# EAGLE design Xadow_IO (EAGLE 6.5.0)
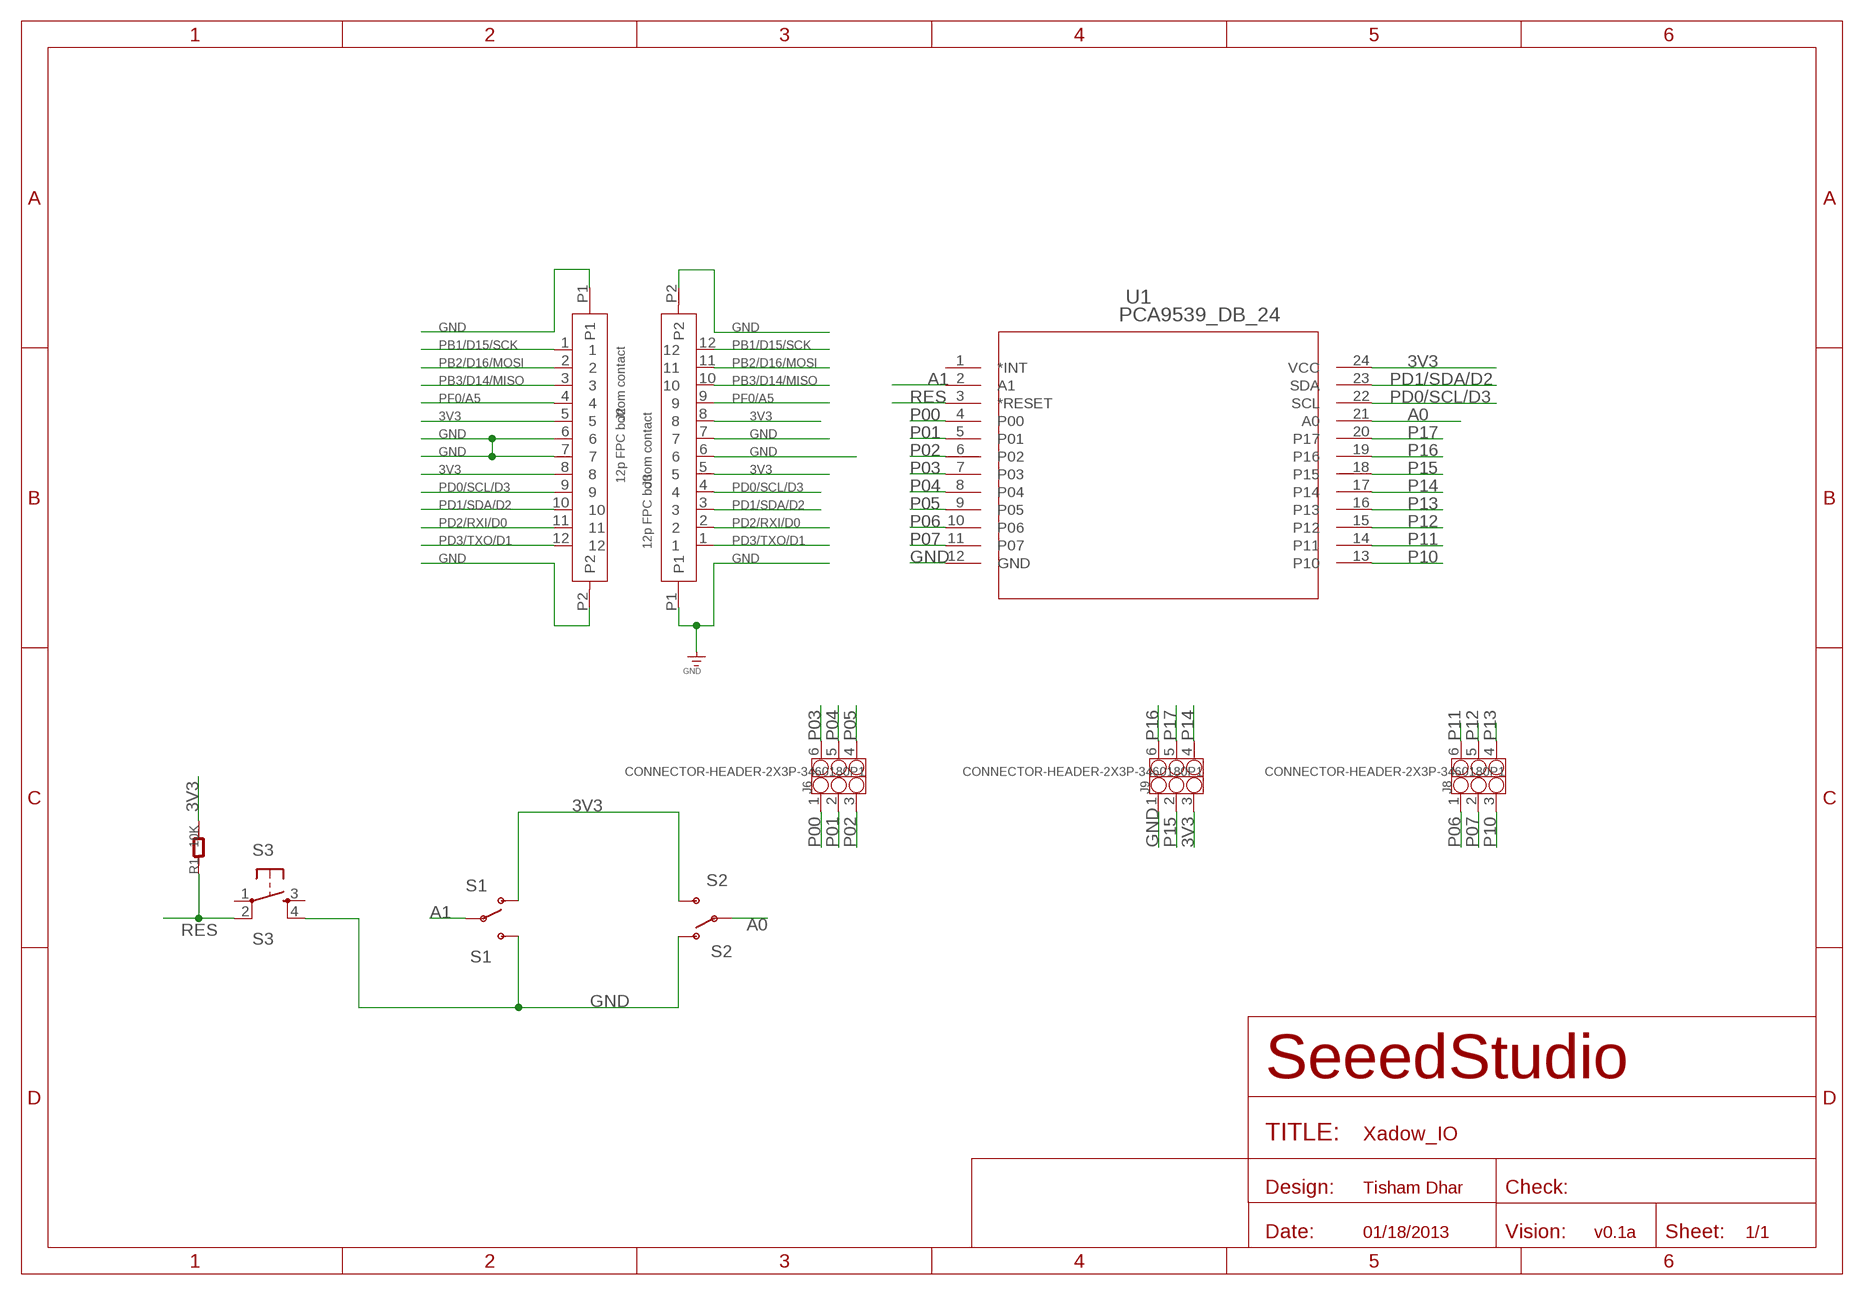
[diagram p0: schematic, sheet 1]

## Parts
J2  12p FPC bottom contact  FPC052002-12LT  [12P-0.5]
J3  12p FPC bottom contact  FPC052002-12LT  [12P-0.5]
J6  CONNECTOR-HEADER-2X3P-3460180P1  [2X3P-2.54-2.54-11.6-3.0-BLACK-MALE]
J8  CONNECTOR-HEADER-2X3P-3460180P1  [2X3P-2.54-2.54-11.6-3.0-BLACK-MALE]
J9  CONNECTOR-HEADER-2X3P-3460180P1  [2X3P-2.54-2.54-11.6-3.0-BLACK-MALE]
R1  10K  R-0603  [R0603]
S1  S1  SWITCH-SPDT-SMD-A  [SWITCH-SPST-SMD-A]
S2  S2  SWITCH-SPDT-SMD-A  [SWITCH-SPST-SMD-A]
S3  S3  TAC_SWITCHSMD  [TACTILE_SWITCH_SMD]
U1  PCA9539_DB_24  [DB24]

## Nets
3V3: J2.5 J2.8 J3.5 J3.8 J9.3 R1.2 S1.1(O) S2.3(S) U1.24(VCC)
A0: S2.2(P) U1.21(A0)
A1: S1.2(P) U1.2(A1)
GND: J2.6 J2.7 J2.P1 J2.P2 J3.6 J3.7 J3.P1 J3.P2 J9.1 S1.3(S) S2.1(O) S3.4 U1.12(GND)
P00: J6.1 U1.4(P00)
P01: J6.2 U1.5(P01)
P02: J6.3 U1.6(P02)
P03: J6.6 U1.7(P03)
P04: J6.5 U1.8(P04)
P05: J6.4 U1.9(P05)
P06: J8.1 U1.10(P06)
P07: J8.2 U1.11(P07)
P10: J8.3 U1.13(P10)
P11: J8.6 U1.14(P11)
P12: J8.5 U1.15(P12)
P13: J8.4 U1.16(P13)
P14: J9.4 U1.17(P14)
P15: J9.2 U1.18(P15)
P16: J9.6 U1.19(P16)
P17: J9.5 U1.20(P17)
PB1/D15/SCK: J2.1 J3.12
PB2/D16/MOSI: J2.2 J3.11
PB3/D14/MISO: J2.3 J3.10
PD0/SCL/D3: J2.9 J3.4 U1.22(SCL)
PD1/SDA/D2: J2.10 J3.3 U1.23(SDA)
PD2/RXI/D0: J2.11 J3.2
PD3/TXO/D1: J2.12 J3.1
PF0/A5: J2.4 J3.9
RES: R1.1 S3.2 U1.3(*RESET)
Unconnected: S3.1 S3.3 U1.1(*INT)

## Notes on the sheet
- Tisham Dhar
- 01/18/2013 | v0.1a

## Library data of the parts
J2 J3 = template:FPC052002-12LT
J6 J8 J9 = OPL:CONNECTOR-HEADER-2X3P
R1 = OPL:R*
S1 S2 = SparkFun-Electromechanical:SWITCH-SPDT: SPDT Switch Simple slide switch, Spark Fun Electronics SKU : COM-00102 DPDT SMT slide switch, AYZ0202, SWCH-08179
S3 = SparkFun-Electromechanical:TAC_SWITCH: Momentary Switch Button commonly used for reset or general input. Spark Fun Electronics SKU : COM-00097 SMT- SWCH-08247; PROD_ID: SWCH-08247
U1 = PCA9539:PCA9539_DB_24; DATASHEETURL: http://www.ti.com/lit/gpn/PCA9539; DESCRIPTION: Remote 16-Bit I2C And SMBus, Low-Power I/O Expander With Interrupt Output, Reset & Config. Registers; FAMILY_NAME: I2C IO EXPANDER; GENERIC_PART_NUMBER: PCA9539; INDUSTRY_STD_PKG_TYPE: SSOP; MANUFACTURER: Texas Instruments; MANUFACTURER_PART_NUMBER: pca9539_db_24; PACKAGE_DESIGNATOR: DB; PIN_COUNT: 24; VENDOR: Texas Instruments

## Net classes
0 default: width 0.152 mm, drill 0.305 mm, clearance 0.152 mm
1 GND: width 0.152 mm, drill 0.305 mm, clearance 0.152 mm to class 0, clearance 0.152 mm
3 usbvcc: width 0.203 mm, drill 0.305 mm, clearance 0.203 mm

## Board
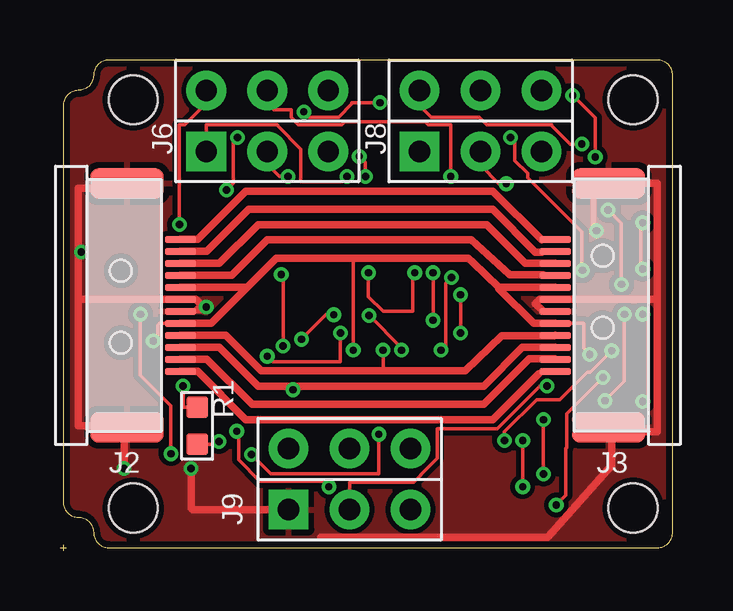
[diagram p1: board, top side]
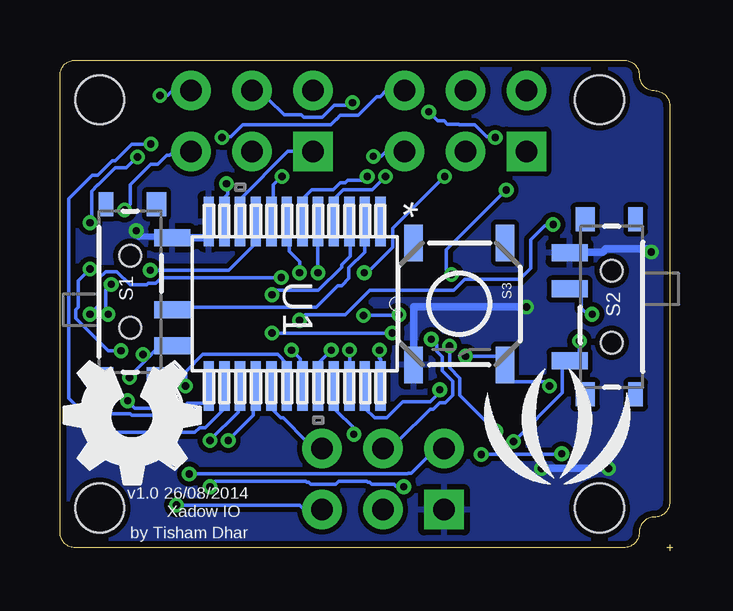
[diagram p2: board, bottom side, seen from below]

Size 25.53 x 20.45 mm. Coordinates in mm from the lower left corner, seen from the top.
Outline: 25.53,19.81 arc90 24.89,20.45
Outline: 2.03,20.45 arc90 1.4,19.81
Outline: 1.4,19.81 arc-90 0.76,19.18
Outline: 0.76,19.18 arc90 0.13,18.54
Outline: 0.13,2.03 arc90 0.76,1.4
Outline: 0.76,1.4 arc-90 1.4,0.76
Outline: 1.4,0.76 arc90 2.03,0.13
Outline: 24.89,0.13 arc90 25.53,0.76
Outline: 25.53,0.76 25.53,19.81
Outline: 25.53,19.81 arc90 24.89,20.45
Outline: 24.89,20.45 2.03,20.45
Outline: 2.03,20.45 arc90 1.4,19.81
Outline: 1.4,19.81 arc-90 0.76,19.18
Outline: 0.76,19.18 arc90 0.13,18.54
Outline: 0.13,18.54 0.13,2.03
Outline: 0.13,2.03 arc90 0.76,1.4
Outline: 0.76,1.4 arc-90 1.4,0.76
Outline: 1.4,0.76 1.4,0.76
Outline: 1.4,0.76 arc90 2.03,0.13
Outline: 2.03,0.13 24.89,0.13
Outline: 24.89,0.13 arc90 25.53,0.76
Outline: 0,0.13 0.25,0.13
Outline: 0.13,0.25 0.13,0
Copper layers (1*16): Top 0.035mm / dielectric 1.5mm / Bottom 0.035mm
Design rules "SeeedStudio_2layer_DRU_no_angle_20140221": minimum track width 6mil, minimum drill 12mil, track to track 6mil, track to pad 6mil, pad to pad 6mil, via to via 6mil, smd to smd 0mil, copper to edge 10mil, drill to drill 10mil, minimum pad ring 10mil, minimum via ring 6mil, stop-mask expansion 2mil, vias tented up to drill 100mil, thermal gap 10mil
Holes 2.03 mm at 3.05,1.78 3.05,18.8 23.88,18.8 23.88,1.78
tRestrict: area 20.3,10 to 21,10.5; area 4.8,10 to 5.3,10.5

### Footprints (pad centres in the part's own frame; a part is rotated, then mirrored left to right if it is on the bottom)
12P-0.5 = smd 0.3 x 1.3: 1 -2.75,2.35; 2 -2.25,2.35; 3 -1.75,2.35; 4 -1.25,2.35; 5 -0.75,2.35; 6 -0.25,2.35; 7 0.25,2.35; 8 0.75,2.35; 9 1.25,2.35; 10 1.75,2.35; 11 2.25,2.35; 12 2.75,2.35 | smd 1.27 x 3.048: P1 -5.08,0.127; P2 5.08,0.127
2X3P-2.54-2.54-11.6-3.0-BLACK-MALE = drill 0.889 pad 1.651 square: 1 -1.27,2.54 | drill 0.889 pad 1.651: 2 -1.27,0; 3 -1.27,-2.54; 4 1.27,-2.54; 5 1.27,0; 6 1.27,2.54
R0603 = smd 0.889 x 0.889: 1 -0.762,0; 2 0.762,0
SWITCH-SPST-SMD-A = smd 0.7 x 1.5: 1 -2.25,-1.75; 2 -0.75,-1.75; 3 2.25,-1.75 | smd 1 x 0.6: GND1 -3.65,1; GND3 3.65,1 | smd 1 x 0.8: GND2 -3.65,-1.1; GND4 3.65,-1.1 | hole 0.9: -1.5,0; 1.5,0
TACTILE_SWITCH_SMD = smd 1.524 x 0.762: 1 -2.54,1.905; 2 2.54,1.905; 3 -2.54,-1.905; 4 2.54,-1.905
DB24 = smd 2.057 x 0.432: 1 -3.429,3.581; 2 -3.429,2.921; 3 -3.429,2.286; 4 -3.429,1.626; 5 -3.429,0.965; 6 -3.429,0.33; 7 -3.429,-0.33; 8 -3.429,-0.965; 9 -3.429,-1.626; 10 -3.429,-2.286; 11 -3.429,-2.921; 12 -3.429,-3.581; 13 3.429,-3.581; 14 3.429,-2.921; 15 3.429,-2.286; 16 3.429,-1.626; 17 3.429,-0.965; 18 3.429,-0.33; 19 3.429,0.33; 20 3.429,0.965; 21 3.429,1.626; 22 3.429,2.286; 23 3.429,2.921; 24 3.429,3.581

### Placement (x,y rotation side)
J2  2.67,10.22 270 top
J3  22.99,10.22 90 top
J6  8.64,17.91 90 top
J8  17.53,17.91 90 top
J9  12.07,2.98 90 top
R1  5.72,5.21 270 top
S1  22.61,10.79 90 bottom
S2  2.54,10.16 270 bottom
S3  8.89,10.29 270 bottom
U1  15.75,10.29 270 bottom
U$2  [LOGO_SILK]  4.83,4.45 0 bottom
U$3  [OSHW_FILLX200_NOTEXT]  19.69,7.87 180 bottom

### Tracks (layer width: path | path; a pad name or v marks a point on that pad's centre or on a via)
3V3  (via drill 0.3)
  Top 0.152: J3.8 20.14,11 20.14,10.98 | 20.19,10.97 20.14,10.98 | 20.14,10.98 20.07,10.99 | 4.88,9.47 J2.8 4.8,9.47 4.14,9.47 4.06,9.4 4.06,8.92 v3.89,8.74 | v20.68,1.91 21.08,2.31 21.08,4.27 21.11,4.29 21.11,5.71 22.61,7.21 v22.63,7.21 | v22.07,8.18 21.82,8.43 21.82,9.47 20.78,9.47 J3.5 | 12.22,12.19 v12.22,8.36 | R1.2 6.53,4.45 v6.63,4.55
  Top 0.305: J2.5 7.8,10.97 | 7.8,10.97 9.02,12.19 12.22,12.19 17.02,12.19 17.2,12.02 18.29,10.99 | J2.8 6.3,9.47 7.8,10.97 | J3.5 19.74,9.47 18.29,10.92 18.29,10.99 | 18.29,10.99 20.64,10.99 J3.8
  Bottom 0.152: v20.68,1.91 15.55,1.91 15.37,1.73 14.61,1.73 J9.3 | v22.63,7.21 22.61,7.24 22.61,7.29 21.9,8 | 21.9,8 21.49,8.41 21.49,8.53 20.88,8.53 S1.1 | 21.9,8 v22.07,8.18 | v3.89,8.74 3.89,7.9 4.27,7.9 S2.3 4.34,7.9 4.6,7.9 4.6,6.58 v6.63,4.55 | U1.24 12.17,7.98 12.22,8.03 v12.22,8.36
A0  (via drill 0.3)
  Top 0.152: v3.35,9.86 3.35,7.32 4.62,6.05 v4.62,4.04 | v7.98,4.01 8.79,3.2 13.28,3.2 v13.28,4.85
  Bottom 0.152: v3.35,9.86 3.56,9.86 3.81,10.11 3.81,10.9 3.84,10.92 4.27,10.92 S2.2 | v4.62,4.04 4.65,4.01 v7.98,4.01 | v13.28,4.85 13.23,4.9 13.23,5.05 14.12,5.94 U1.21
A1
  Bottom 0.152: U1.2 12.83,12.45 13.49,11.79 13.49,11.35 13.79,11.05 13.95,11.05 14.86,10.14 20.12,10.14 20.22,10.03 S1.2
GND  (via drill 0.3)
  Top 0.152: 4.47,9.98 4.75,9.98 4.78,9.96 5,9.96 J2.7 5.08,9.96 5.39,9.96 5.41,9.98 5.59,9.98 5.72,10.03 | 20.07,10.03 20.19,9.98 20.24,9.98 20.27,9.96 20.62,9.96 J3.6 20.7,9.96 21.01,9.96 21.03,9.98
  Top 0.254: v22.35,13.34 22.23,13.46 22.23,15.24 J3.P2
  Top 0.305: 5.84,10.16 5.84,10.29 5.66,10.47 J2.6 0.76,10.47 | 5.84,10.16 5.72,10.03 | 20.07,10.03 19.81,10.29 20,10.47 J3.7 24.89,10.47 | J9.1 5.53,1.71 5.46,1.78 v5.46,3.43 | 0.76,10.47 0.76,12.45 | 0.76,12.45 0.76,15.11 1.65,15.11 1.65,15.24 | 0.76,10.47 0.76,5.21 2.67,5.21 2.73,5.14 J2.P2 2.67,5.08 v2.67,3.43 | 24.89,10.47 24.89,15.3 J3.P2 22.73,15.37 22.23,15.37 | 24.89,10.47 24.89,4.95 22.86,4.95 J3.P1 22.99,5.14 22.99,3.56 20.32,0.57 10.86,0.57 | v6.1,10.16 5.97,10.03 5.84,10.03 5.84,10.16 | v0.89,12.45 0.76,12.45
  Bottom 0.254: S1.3 21.08,13.08 22.23,13.08 22.35,13.21 v22.35,13.34
  Bottom 0.305: U1.12 19.33,13.04 S1.3 20.95,13.08 | S3.4 10.8,10.16 v6.1,10.16 | S2.1 4.19,12.45 2.92,12.45 2.79,12.57 0.89,12.57 0.76,12.45 v0.89,12.45 | v5.46,3.43 v2.67,3.43
  pour Top (isolate 0.203): 0.13,0.13 25.53,0.13 25.53,20.45 0.13,20.45
  pour Bottom (isolate 0.203): 0.13,0.13 25.53,0.13 25.53,20.45 0.13,20.45
P00  (via drill 0.3)
  Top 0.152: v11.96,15.6 11.73,15.37 10.03,15.37 10.03,16.74 9.07,17.7 9.07,17.73 9.04,17.75 6.1,17.75 J6.1
  Bottom 0.152: U1.4 14.12,14.66 14.1,14.66 13.72,15.04 12.52,15.04 v11.96,15.6
P01  (via drill 0.3)
  Top 0.152: J6.2 8.64,16.1 9.14,15.6 v9.5,15.6 | v12.85,11.58 12.85,10.59 13.46,9.98 14.71,9.98 14.71,11.51 v14.78,11.58
  Bottom 0.152: v9.5,15.6 11.66,13.44 11.66,12.65 12.7,11.61 12.83,11.61 v12.85,11.58 | U1.5 v14.78,11.58
P02  (via drill 0.3)
  Top 0.152: v12.47,16.43 12.73,16.18 v12.73,15.6
  Bottom 0.152: J6.3 11.94,16.64 12.14,16.43 v12.47,16.43 | v12.73,15.6 12.88,15.44 13.54,15.44 13.64,15.34 13.84,15.34 14.15,15.04 15.04,15.04 15.42,14.66 U1.6
P03  (via drill 0.3)
  Top 0.152: J6.6 6.1,18.64 5.21,17.75 4.98,17.75 v4.98,13.59 | v15.55,11.58 v15.55,9.6
  Bottom 0.152: v4.98,13.59 5.03,13.54 5.33,13.54 5.92,12.95 5.92,11.76 6.38,11.3 8.66,11.3 9.12,10.85 12.62,10.85 13.64,9.83 15.32,9.83 v15.55,9.6 | v15.55,11.58 15.55,12.04 15.98,12.47 15.98,12.75 16.08,12.85 U1.7
P04  (via drill 0.3)
  Top 0.152: J6.5 8.64,18.64 8.92,18.36 9.63,18.36 9.63,18.06 9.93,17.75 11.73,17.75 11.86,17.88 15.22,17.88 15.34,17.75 16.28,17.75 v16.28,15.6
  Bottom 0.152: v16.28,15.6 16.64,15.24 16.64,14.68 16.71,14.61 U1.8
P05  (via drill 0.3)
  Top 0.152: v18.77,17.22 18.95,17.04 18.95,16.26 19.48,15.72 19.48,15.54 21.74,13.28 21.74,11.71 v21.77,11.68
  Bottom 0.152: J6.4 11.94,19.18 12.19,18.92 12.32,18.92 13.11,18.14 13.84,18.14 14,17.98 14.02,17.98 14.25,17.75 17.91,17.75 18.41,17.25 18.75,17.25 v18.77,17.22 | v21.77,11.68 21.74,11.66 21.46,11.66 21.44,11.68 18.49,11.68 17.37,12.8 U1.9
P06
  Bottom 0.152: J8.1 16.03,16.64 18.03,14.63 U1.10
P07  (via drill 0.3)
  Top 0.152: v18.59,15.29 18.29,15.29 17.53,16.05 J8.2
  Bottom 0.152: U1.11 18.67,14.73 18.54,14.86 18.54,15.24 v18.59,15.29
P10  (via drill 0.3)
  Top 0.152: v22.71,6.25 23.52,7.06 v23.52,9.86 | v23.39,11.1 23.39,13.64 v22.84,14.2
  Bottom 0.152: U1.13 19.33,6.15 20.22,6.15 20.42,5.94 22.4,5.94 v22.71,6.25 | v23.52,9.86 23.62,9.96 23.62,10.87 v23.39,11.1 | v22.84,14.2 22.61,14.43 22.61,15.24 21.74,16.1 21.46,16.1 21.08,16.49 20.95,16.49 20.8,16.64 J8.3
P11  (via drill 0.3)
  Top 0.152: J8.6 14.99,18.54 15.47,18.06 17.48,18.06 17.78,17.75 20.5,17.75 20.5,17.7 21.26,16.94 v21.74,16.94
  Bottom 0.152: v21.74,16.94 22.53,16.94 23.22,16.26 23.34,16.26 23.95,15.65 24.18,15.65 25.17,14.66 25.17,6.35 23.75,4.93 19.91,4.93 19.71,5.13 19.48,5.13 18.67,5.94 U1.14
P12  (via drill 0.3)
  Top 0.152: v13.34,18.67 12.17,18.67 12.17,18.62 11.61,18.06 10.39,18.06 v10.16,18.29 | v7.39,17.22 7.21,17.04 7.21,15.32 v6.93,15.04 | v9.22,11.51 9.3,11.43 v9.3,8.53 | v7.37,4.98 7.44,4.9 7.44,3.79 8.33,2.9 11.07,2.9 11.07,2.79 v11.2,2.67 | v19.28,4.6 v19.28,2.67
  Bottom 0.152: J8.5 16.99,19.18 16.87,19.05 16.87,18.82 16.84,18.82 16.18,18.16 15.47,18.16 15.37,18.06 14.61,18.06 14.1,18.57 13.61,18.57 13.51,18.67 v13.34,18.67 | v10.16,18.29 9.78,17.91 9.53,17.91 9.4,17.78 8.92,17.78 8.89,17.75 8.26,17.75 7.75,17.25 7.42,17.25 v7.39,17.22 | v6.93,15.04 9.42,12.55 9.42,11.71 v9.22,11.51 | v9.3,8.53 9.3,7.62 8.87,7.19 8.87,6.48 v7.37,4.98 | v11.2,2.67 11.23,2.69 11.53,2.69 11.61,2.77 12.55,2.77 12.62,2.85 12.7,2.85 12.75,2.9 13.92,2.9 14.05,2.77 15.09,2.77 15.16,2.85 15.24,2.85 15.29,2.9 19.05,2.9 v19.28,2.67 | v19.28,4.6 18.11,5.77 18.11,5.89 18.03,5.97 U1.15
P13  (via drill 0.3)
  Top 0.152: v21.36,18.97 22.3,18.03 v22.3,16.41 | v24.28,13.67 24.21,13.59 24.21,11.81 v24.28,11.74 | v22.99,8.33 22.1,7.44 21.97,7.44 20.83,6.3 19.86,6.3 18.52,4.95 v18.52,4.6
  Bottom 0.152: J8.4 20.83,19.18 21.03,18.97 v21.36,18.97 | v22.3,16.41 22.76,15.95 23.22,15.95 23.93,15.24 23.95,15.24 24.21,14.99 24.21,13.74 v24.28,13.67 | v24.28,11.74 24.77,11.25 24.77,10.14 24.87,10.03 24.87,9.68 23.52,8.33 v22.99,8.33 | v18.52,4.6 17.48,5.64 17.48,5.89 17.37,5.99 U1.16
P14
  Bottom 0.152: U1.17 16.71,5.92 16.33,5.54 16.23,5.54 15.24,4.55 15.24,4.27 14.61,4.27 J9.4
P15  (via drill 0.3)
  Top 0.152: v20.3,6.86 19.99,6.86 18.21,5.08 15.72,5.08 15.72,3.86 15.04,3.18 15.04,3.15 14.73,2.85 12.07,2.85 J9.2
  Bottom 0.152: U1.18 16.08,7.8 16.46,8.18 19.58,8.18 20.3,7.47 v20.3,6.86
P16  (via drill 0.3)
  Top 0.152: v20.14,5.46 v20.14,3.2 | v24.28,6.22 24.51,6.45 24.51,9.63 v24.28,9.86 | v16.31,11.38 16.08,11.15 16.08,8.56 v15.88,8.36
  Bottom 0.152: v20.14,3.2 11.05,3.2 11.02,3.23 10.9,3.23 10.21,3.91 10.19,3.91 10.19,4.14 10.06,4.27 9.53,4.27 J9.6 | v20.14,5.46 20.24,5.46 20.42,5.64 22.53,5.64 22.61,5.71 23.77,5.71 v24.28,6.22 | v24.28,9.86 23.93,10.21 23.93,11.33 23.62,11.63 23.16,11.63 22.61,11.07 21.92,11.07 21.84,11.15 21.54,11.15 21.31,11.38 v16.31,11.38 | v15.88,8.36 15.52,8 15.52,7.82 15.42,7.72 U1.19
P17  (via drill 0.3)
  Top 0.152: v10.06,8.81 11.07,9.83 v11.41,9.83 | v12.88,9.8 14.22,8.46 v14.22,8.36
  Bottom 0.152: v10.06,8.81 9.83,8.59 9.83,8.31 9.6,8.08 9.6,7.49 9.17,7.06 9.17,6.48 9.47,6.17 9.7,6.17 9.98,5.89 10.11,5.89 11.41,4.6 11.41,4.39 11.53,4.27 12.07,4.27 J9.5 | v11.41,9.83 11.43,9.8 v12.88,9.8 | v14.22,8.36 14.78,7.8 U1.20
PB1/D15/SCK
  Top 0.152: J3.12 20.19,12.98 20.07,12.95
  Top 0.305: J2.1 5.73,12.97 7.75,14.99 18.03,14.99 20.07,12.95
PB2/D16/MOSI
  Top 0.152: J3.11 20.19,12.47 20.07,12.45
  Top 0.305: J2.2 6.12,12.47 7.87,14.22 18.03,14.22 19.81,12.45 20.07,12.45
PB3/D14/MISO
  Top 0.305: J2.3 6.64,11.97 8.26,13.59 17.78,13.59 19.4,11.97 J3.10
PD0/SCL/D3  (via drill 0.3)
  Top 0.152: 13.46,7.49 v13.46,8.36
  Top 0.305: J2.9 6.9,8.97 8.38,7.49 13.46,7.49 16.89,7.49 18.41,8.95 20.59,8.95 J3.4
  Bottom 0.152: v13.46,8.36 U1.22
PD1/SDA/D2  (via drill 0.3)
  Top 0.152: 8.69,6.88 8.69,6.86 | v9.7,6.71 9.7,6.86
  Top 0.305: J2.10 6.64,8.47 8.26,6.86 8.69,6.86 9.7,6.86 17.65,6.86 19.27,8.47 J3.3
  Bottom 0.152: U1.23 12.83,5.92 12.8,5.92 12.42,5.54 11.91,5.54 11.25,6.2 10.11,6.2 9.7,6.6 v9.7,6.71
PD2/RXI/D0
  Top 0.305: J2.11 6.12,7.97 8,6.1 17.65,6.1 19.56,8 20.61,8 J3.2
PD3/TXO/D1
  Top 0.152: J3.1 20.07,7.47 20.07,7.44 19.94,7.37
  Top 0.305: J2.12 5.73,7.47 7.75,5.46 18.03,5.46 19.94,7.37
PF0/A5
  Top 0.152: J3.9 20.27,11.48 20.13,11.49
  Top 0.305: J2.4 7.16,11.47 8.64,12.95 17.15,12.95 18.73,11.49 20.13,11.49
RES  (via drill 0.3)
  Top 0.152: v8.64,8.1 8.87,7.87 11.68,7.87 v11.68,9.07 | v16.69,10.67 v16.69,9.07 | R1.1 5.13,5.97 v5.13,6.86
  Bottom 0.152: v8.64,8.1 6.99,8.1 S3.2 6.99,7.06 6.96,7.04 5.31,7.04 v5.13,6.86 | v16.69,9.07 v11.68,9.07 | v16.69,10.67 16.51,10.85 14.76,10.85 13.79,11.81 13.79,11.91 13.44,12.27 13.44,12.98 13.46,13 U1.3

### Text on the board
bPlace: v1.0 26/08/2014 | Xadow IO | by Tisham Dhar